# EAGLE schematic export (EAGLE 7.5.0)

## Sheet 1 of 3
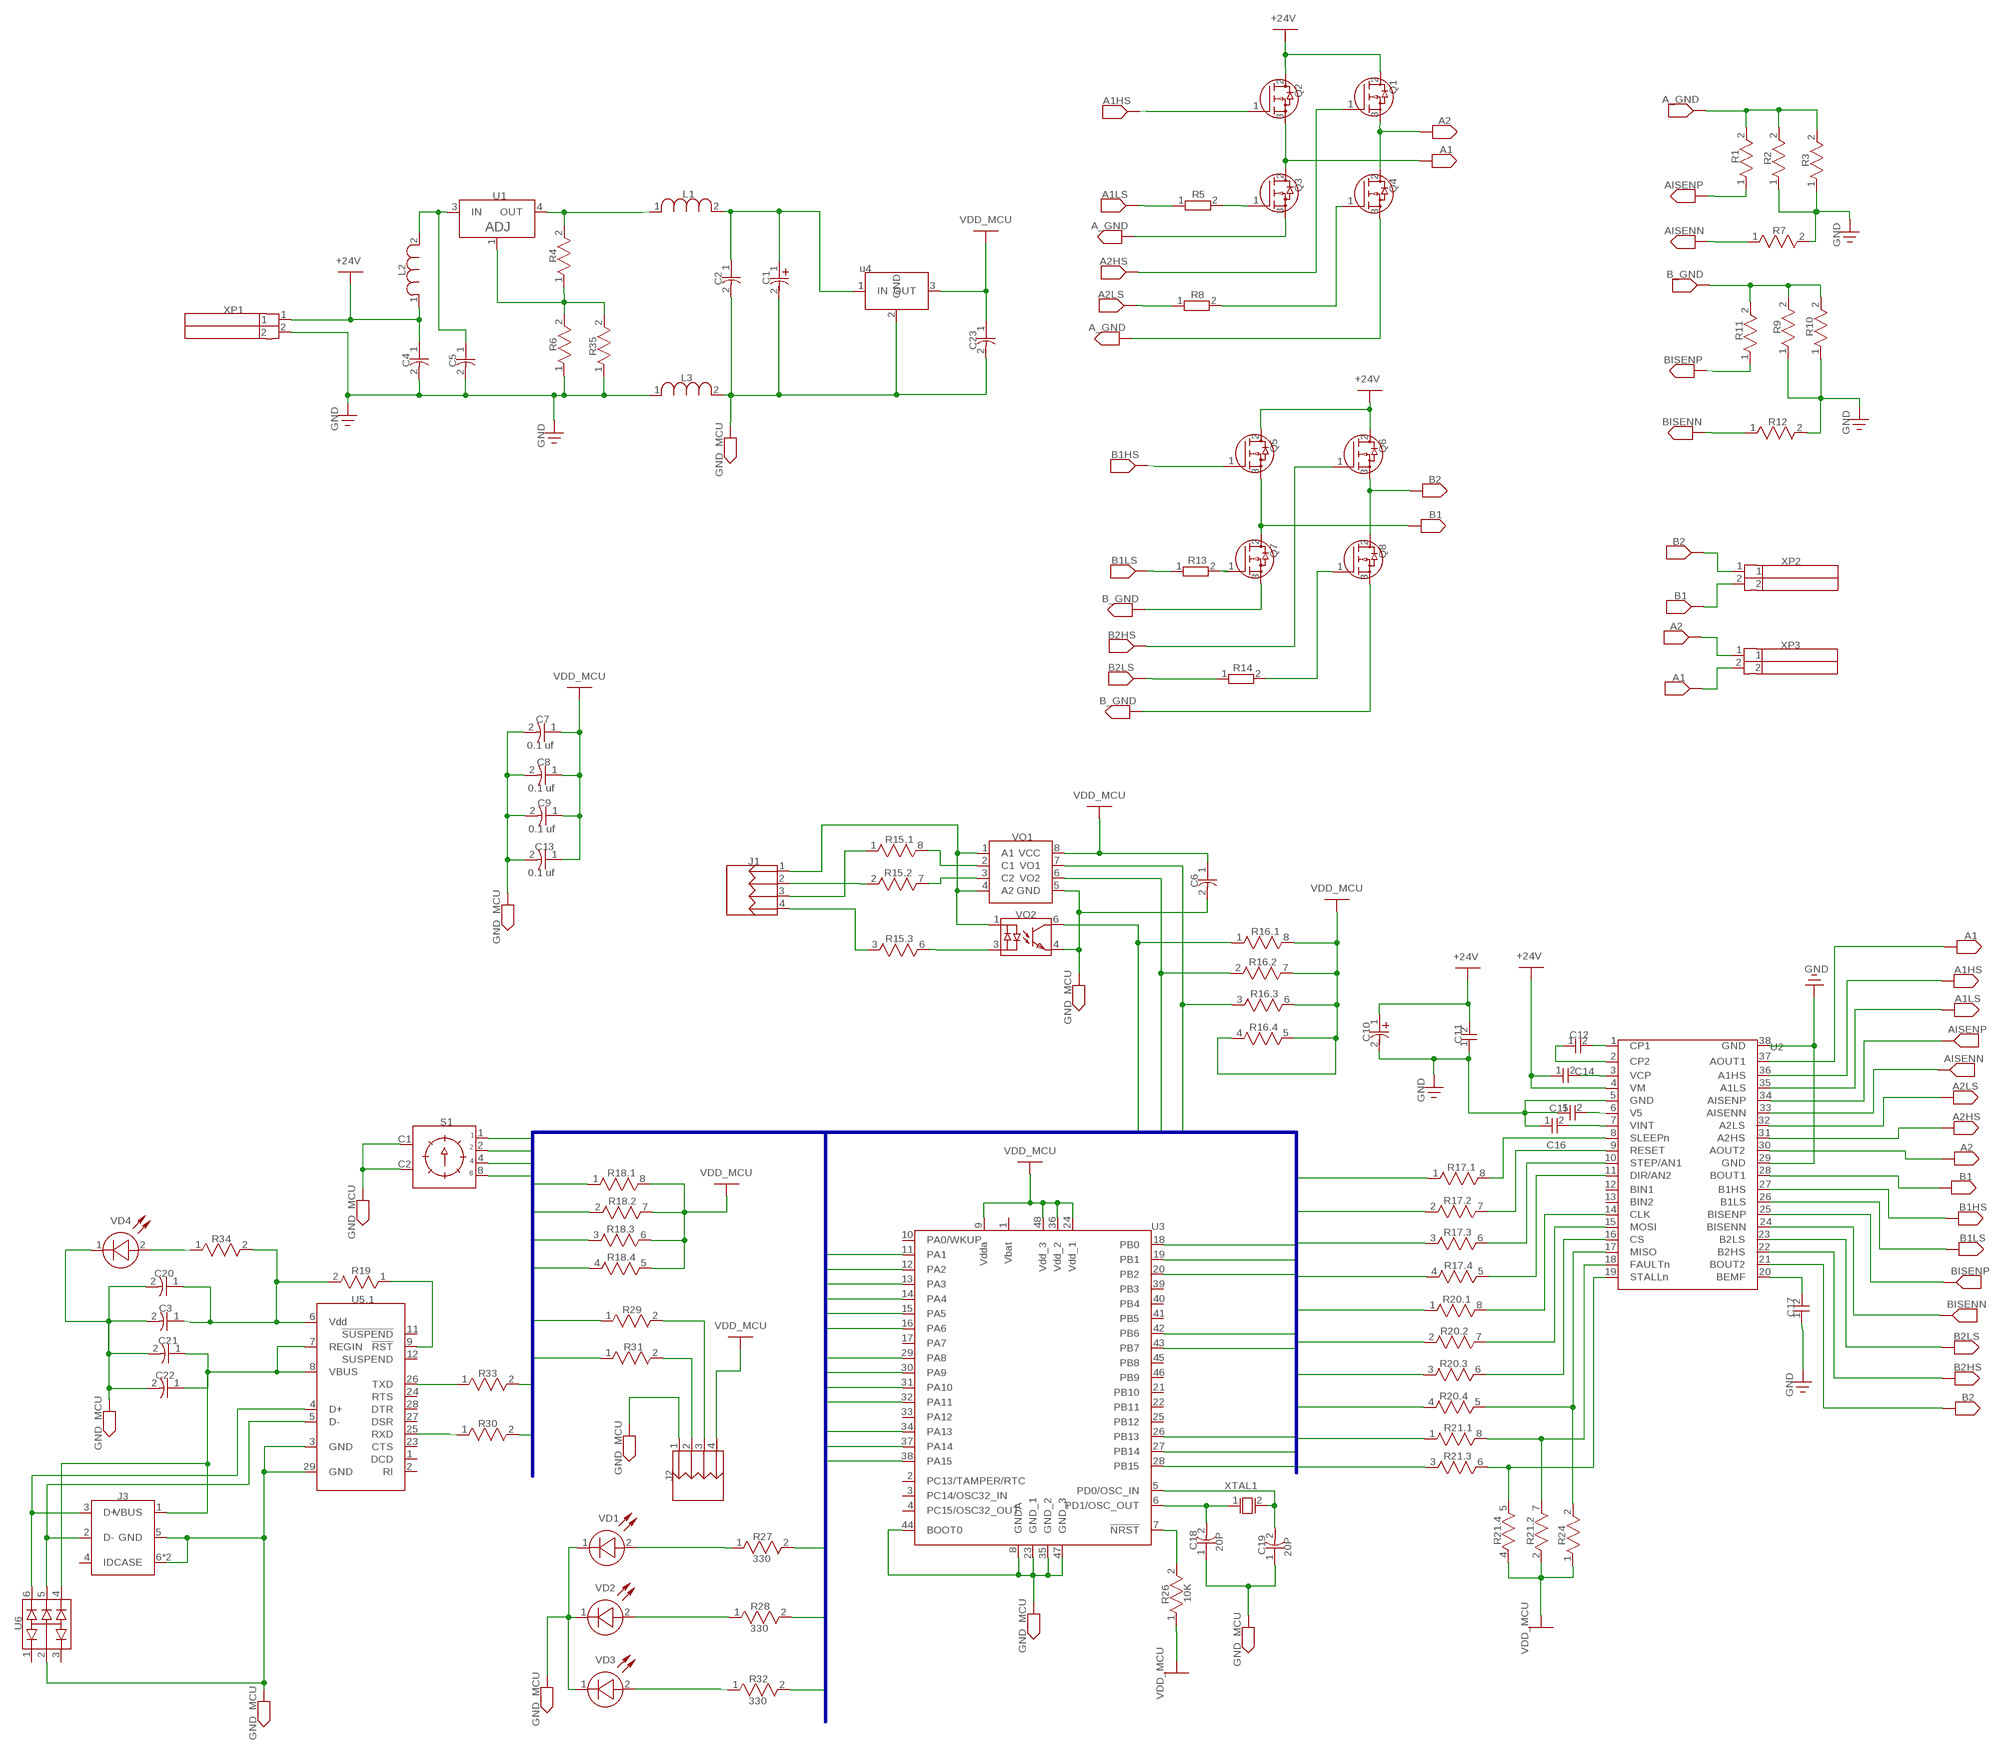
[diagram p0: schematic, sheet 1]

### Parts
C1  220 uf  CAPAE_5.3X5.3H6.1  [CAPAE-5.3X5.3H6.1]
C2  0.1 uf  CAP_0805  [CAP_0805]
C3  CAP_0603  [CAP_0603]
C4  0.1 uf  CAP_0805  [CAP_0805]
C5  0.1 uf  CAP_0805  [CAP_0805]
C6  0.1 uf  CAP_0603  [CAP_0603]
C7  0.1 uf  CAP_0603  [CAP_0603]
C8  0.1 uf  CAP_0603  [CAP_0603]
C9  0.1 uf  CAP_0603  [CAP_0603]
C10  470 uf  CAPAE_6.6X6.6H5.4  [CAPAE-6.6X6.6H5.4]
C11  0.01 uf  SMD_0805  [SMD_0805]
C12  0.1 uf  SMD_0805  [SMD_0805]
C13  0.1 uf  CAP_0603  [CAP_0603]
C14  1 uf  SMD_0805  [SMD_0805]
C15  0.1 uf  SMD_0805  [SMD_0805]
C16  1 uf  SMD_0805  [SMD_0805]
C17  1000 pf  SMD_0805  [SMD_0805]
C18  20P  CAP_0603  [CAP_0603]
C19  20P  CAP_0603  [CAP_0603]
C20  CAP_0603  [CAP_0603]
C21  CAP_0603  [CAP_0603]
C22  CAP_0603  [CAP_0603]
C23  CAP_0805  [CAP_0805]
J1  644456-4  [HDR-1X4T/2.54/10X2]
J2  644456-4  [HDR-1X4T/2.54/10X2]
J3  1734035-1  [1734035]
L1  BLM21PG331SN1D  IND_0805  [IND_0805]
L2  BLM21PG331SN1D  IND_0805  [IND_0805]
L3  BLM21PG331SN1D  IND_0805  [IND_0805]
Q1  CSD18537NKCS  [TO-220_16]
Q2  CSD18537NKCS  [TO-220_16]
Q3  CSD18537NKCS  [TO-220_16]
Q4  CSD18537NKCS  [TO-220_16]
Q5  CSD18537NKCS  [TO-220_16]
Q6  CSD18537NKCS  [TO-220_16]
Q7  CSD18537NKCS  [TO-220_16]
Q8  CSD18537NKCS  [TO-220_16]
R1  0  RES_1206  [RES_1206]
R2  0.01  RES_2512  [RES_2512]
R3  0.01  RES_2512  [RES_2512]
R4  240  RES_0805  [RES_0805]
R5  75  SMD_0805_53  [SMD_0805_54]
R6  750  RES_0805  [RES_0805]
R7  0  RES_1206  [RES_1206]
R8  75  SMD_0805_53  [SMD_0805_54]
R9  0.01  RES_2512  [RES_2512]
R10  0.01  RES_2512  [RES_2512]
R11  0  RES_1206  [RES_1206]
R12  0  RES_1206  [RES_1206]
R13  75  SMD_0805_53  [SMD_0805_54]
R14  75  SMD_0805_53  [SMD_0805_54]
R15  470  ACAS0612AT  [RESCAX-8/1.5X3.2X0.8]
R16  4.7k  ACAS0612AT_18  [RESCAX-8/1.5X3.2X0.8]
R17  120  ACAS0612AT_18  [RESCAX-8/1.5X3.2X0.8]
R18  4.7k  ACAS0612AT_18  [RESCAX-8/1.5X3.2X0.8]
R19  RES_0603  [RES_0603]
R20  120  ACAS0612AT_18  [RESCAX-8/1.5X3.2X0.8]
R21  120  ACAS0612AT_18  [RESCAX-8/1.5X3.2X0.8]
R24  4.7k  RES_0603  [RES_0603]
R26  10K  RES_0603  [RES_0603]
R27  330  RES_0603  [RES_0603]
R28  330  RES_0603  [RES_0603]
R29  120  RES_0603  [RES_0603]
R30  120  RES_0603  [RES_0603]
R31  120  RES_0603  [RES_0603]
R32  330  RES_0603  [RES_0603]
R33  120  RES_0603  [RES_0603]
R34  RES_0603  [RES_0603]
R35  910  RES_0805  [RES_0805]
S1  CD08RM0CB  [CD-C]
U1  LM317D2T  [TO263-3(4)/15X10X2.54]
U2  DRV8711  [PDSOP-G38]
U3  STM32F103C8  [STM32F103C8]
u4  SPX3940-3.3  [TO263-4/10.5X9X2.54]
U5  CP2102  [QFN-28/5X5X0.5]
U6  MF05C  [SMF05C]
VD1  SMD_0805_R  [SMD_0805_R]
VD2  SMD_0805_R  [SMD_0805_R]
VD3  SMD_0805_R  [SMD_0805_R]
VD4  SMD_0805_G  [SMD_0805_G]
VO1  TLP2160  [SOIC-8/150MIL]
VO2  TLP126  [SOP-4V1/7X2.54]
XP1  306_2  [306_2]
XP2  300_2_5  [300_2_5]
XP3  300_2_5  [300_2_5]
XTAL1  8MHz  NX5032GA  [NX5032GA]

### Nets
3V3: C6.1 C7.1 C8.1 C9.1 C13.1 C23.1 J2.4 R16.4 R16.5 R16.6 R16.7 R16.8 R18.5 R18.6 R18.7 R18.8 R21.2 R21.4 R24.1 R26.1 U3.9(Vdda) U3.24(Vdd_1) U3.36(Vdd_2) U3.48(Vdd_3) u4.3(OUT) VO1.8(VCC) ; supply symbol labelled VDD_MCU
A1: Q2.3 Q3.2 U2.37(AOUT1) XP3.2 ; supply symbol labelled A1_46
A1HS: Q2.1 U2.36(A1HS) ; supply symbol labelled A1HS_65
A1LS: R5.1 U2.35(A1LS) ; supply symbol labelled A1LS_21
A2: Q1.3 Q4.2 U2.30(AOUT2) XP3.1 ; supply symbol labelled A2_37
A2HS: Q1.1 U2.31(A2HS) ; supply symbol labelled A2HS_23
A2LS: R8.1 U2.32(A2LS) ; supply symbol labelled A2LS_31
ADDR_0: R18.1 S1.1 U3.29(PA8)
ADDR_1: R18.2 S1.2 U3.30(PA9)
ADDR_2: R18.3 S1.4 U3.31(PA10)
ADDR_3: R18.4 S1.8 U3.32(PA11)
AISENN: R7.1 U2.33(AISENN) ; supply symbol labelled AISENN_58
AISENP: R1.1 U2.34(AISENP) ; supply symbol labelled AISENP_61
B1: Q5.3 Q7.2 U2.28(BOUT1) XP2.2 ; supply symbol labelled B1_44
B1HS: Q5.1 U2.27(B1HS) ; supply symbol labelled B1HS_26
B1LS: R13.1 U2.26(B1LS) ; supply symbol labelled B1LS_33
B2: Q6.3 Q8.2 U2.21(BOUT2) XP2.1 ; supply symbol labelled B2_3
B2HS: Q6.1 U2.22(B2HS) ; supply symbol labelled B2HS_41
B2LS: R14.1 U2.23(B2LS) ; supply symbol labelled B2LS_29
BEMF: C17.2 U2.20(BEMF)
BISENN: R12.1 U2.24(BISENN) ; supply symbol labelled BISENN_39
BISENP: R11.1 U2.25(BISENP) ; supply symbol labelled BISENP_15
CLK_MCU: R20.1 U3.15(PA5)
CP1: C12.2 U2.1(CP1)
CP2: C12.1 U2.2(CP2)
CS_MCU: R20.3 U3.16(PA6)
DIR: R16.3 R17.4 VO1.7(VO1)
E_LED: R27.2 U3.26(PB13)
EN: R16.1 U3.20(PB2) VO2.6(C)
ERROR: R21.1 U3.19(PB1)
GND: C4.2 C5.2 C10.2(MINUS) C11.1 C15.1 C16.1 C17.1 L3.1 R2.1 R3.1 R6.1 R7.2 R9.1 R10.1 R12.2 R35.1 U2.5(GND) U2.29(GND) U2.38(GND) XP1.2 ; supply symbol labelled GND_10
GND_A: Q3.3 Q4.3 R1.2 R2.2 R3.2 ; supply symbol labelled A_GND, A_GND_67
GND_B: Q7.3 Q8.3 R9.2 R10.2 R11.2 ; supply symbol labelled B_GND, B_GND_5
GND_MCU: C1.2(MINUS) C2.2 C3.2 C6.2 C7.2 C8.2 C9.2 C13.2 C18.1 C19.1 C20.2 C21.2 C22.2 C23.2 J2.1 J3.5(GND) J3.6(CASE) J3.8(CASE) L3.2 S1.C1 S1.C2 U3.8(GNDA) U3.23(GND_1) U3.35(GND_2) U3.44(BOOT0) U3.47(GND_3) u4.2(GND) U5.3(GND) U5.29(GND) U6.2 VD1.1 VD2.1 VD3.1 VD4.1 VO1.5(GND) VO2.4(E)
MISO_MCU: R20.4 U3.13(PA3)
MOSI_MCU: R20.2 U3.14(PA4)
Net_0: R17.7 U2.9(RESET)
Net_1: R17.5 U2.11(DIR/AN2)
Net_2: R20.7 U2.15(MOSI)
Net_3: R26.2 U3.7(!NRST)
Net_4: R28.1 VD2.2
Net_5: R27.1 VD1.2
Net_6: R20.6 U2.16(CS)
Net_7: C5.1 L2.2 U1.3(IN)
Net_8: R30.1 U5.25(RXD)
Net_9: Q4.1 R8.2
Net_10: R33.1 U5.26(TXD)
Net_11: J3.3(D+) U5.4(D+) U6.6
Net_12: J3.2(D-) U5.5(D-) U6.5
Net_13: R19.1 U5.9(!RST)
Net_14: R34.1 VD4.2
Net_15: J1.4 R15.3
Net_16: C1.1(PLUS) C2.1 L1.2 u4.1(IN)
Net_27: Q3.1 R5.2
Net_28: R17.8 U2.8(SLEEPn)
Net_29: Q7.1 R13.2
Net_30: R17.6 U2.10(STEP/AN1)
Net_31: R4.1 R6.2 R35.2 U1.1(ADJ)
Net_32: R20.8 U2.14(CLK)
Net_33: C18.2 U3.6(PD1/OSC_OUT) XTAL1.1
Net_34: C19.2 U3.5(PD0/OSC_IN) XTAL1.2
Net_35: R20.5 R24.2 U2.17(MISO)
Net_36: R21.7 R21.8 U2.18(FAULTn)
Net_41: L1.1 R4.2 U1.4(OUT)
Net_64: R21.5 R21.6 U2.19(STALLn)
Net_72: R15.6 VO2.3(CA)
Net_73: J1.1 VO1.1(A1) VO1.4(A2) VO2.1(AC)
Net_74: R15.8 VO1.2(C1)
Net_75: R15.7 VO1.3(C2)
Net_76: J1.2 R15.2
Net_77: J1.3 R15.1
Net_78: R32.1 VD3.2
Net_90: J2.3 R29.2
Net_91: J2.2 R31.2
Net_92: C21.1 C22.1 J3.1(VBUS) U5.7(REGIN) U5.8(VBUS) U6.4
Net_93: C3.1 C20.1 R19.2 R34.2 U5.6(Vdd)
Net_94: Q8.1 R14.2
RESET: R17.2 U3.12(PA2)
RX: R33.2 U3.43(PB7)
S_LED: R28.2 U3.27(PB14)
SEL_CLK: U3.38(PA15)
SLEEP: R17.1 U3.11(PA1)
STALL: R21.3 U3.18(PB0)
STEP: R16.2 R17.3 VO1.6(VO2)
SWCLK: R31.1 U3.37(PA14)
SWDIO: R29.1 U3.34(PA13)
TX: R30.2 U3.42(PB6)
V5: C15.2 U2.6(V5)
VCP: C14.2 U2.3(VCP)
VINT: C16.2 U2.7(VINT)
VM: C4.1 C10.1(PLUS) C11.2 C14.1 L2.1 Q1.2 Q2.2 Q5.2 Q6.2 U2.4(VM) XP1.1 ; supply symbol labelled +24V
W_LED: R32.2 U3.28(PB15)
Unconnected: J3.4(ID) U2.12(BIN1) U2.13(BIN2) U3.2(PC13/TAMPER/RTC) U3.3(PC14/OSC32_IN) U3.4(PC15/OSC32_OUT) U3.10(PA0/WKUP) U3.17(PA7) U3.21(PB10) U3.22(PB11) U3.25(PB12) U3.33(PA12) U3.39(PB3) U3.40(PB4) U3.41(PB5) U3.45(PB8) U3.46(PB9) U5.1(DCD) U5.2(RI) U5.11(!SUSPEND) U5.12(SUSPEND) U5.23(CTS) U5.24(RTS) U5.27(DSR) U5.28(DTR) U6.1 U6.3

### Buses
E_LED,CS_MCU,CLK_MCU,MOSI_MCU,MISO_MCU,ADDR_0,ADDR_1,ADDR_2,ADDR_3,RX,TX,SWDIO,SWCLK,STALL,ERROR,EN,DIR,STEP,SLEEP,RESET,S_LED,W_LED,SEL_CLK

### Notes on the sheet
- +24V
- Q1
- Q2
- A1HS | A_GND
- A2
- A1
- R1 | R2
- R3
- AISENP
- Q3 | Q4
- U1 | L1 | A1LS | R5
- ADJ | VDD_MCU
- A_GND
- AISENN | R7
- GND
- +24V | R4 | A2HS
- u4
- L2 | B_GND
- C2 | C1
- A2LS | R8
- XP1
- A_GND | R9
- R10
- R11
- R6 | C23
- R35
- BISENP
- C4 | C5
- L3 | +24V
- BISENN | R12
- GND
- GND
- GND
- Q5 | Q6
- B1HS
- GND_MCU
- B2
- B1
- B2
- Q7 | Q8
- B1LS | R13 | XP2
- B1
- B_GND
- A2
- B2HS
- XP3
- B2LS | R14
- VDD_MCU | A1
- B_GND
- C7
- 0.1 uf
- C8
- 0.1 uf
- VDD_MCU
- C9
- 0.1 uf
- R15.1 | VO1
- C13
- J1
- 0.1 uf
- R15.2
- C6
- VDD_MCU
- VO2
- R16.1
- R15.3 | A1
- GND_MCU
- +24V | +24V
- R16.2
- GND | A1HS
- R16.3
- A1LS
- GND_MCU
- R16.4 | AISENP
- C12
- C10 | C11
- U2
- AISENN
- C14
- A2LS
- GND
- C15
- A2HS
- S1
- 1
- 2
- C16 | A2
- VDD_MCU
- 4
- 8 | R17.1
- R18.1 | VDD_MCU
- B1
- R18.2 | R17.2
- B1HS
- VD4
- R18.3 | U3
- R17.3
- GND_MCU | B1LS
- R34
- R18.4
- R17.4
- C20 | R19 | BISENP
- U5.1 | R20.1
- BISENN
- C3 | R29
- C17
- VDD_MCU
- R20.2
- B2LS
- C21
- R31
- R20.3
- B2HS
- C22 | R33
- GND
- R20.4 | B2
- R30
- R21.1
- GND_MCU
- R21.3
- GND_MCU
- J2
- XTAL1
- J3
- VD1
- R27
- R21.4 | R21.2 | R24
- C18 | 20P
- 330 | C19 | 20P
- VD2
- R26 | 10K
- R28
- 330
- U6
- GND_MCU | VDD_MCU
- VD3 | GND_MCU
- R32
- 330 | VDD_MCU
- GND_MCU
- GND_MCU

## Sheet 2 of 3

### Buses
E_LED,CS_MCU,CLK_MCU,MOSI_MCU,MISO_MCU,ADDR_0,ADDR_1,ADDR_2,ADDR_3,RX,TX,SWDIO,SWCLK,STALL,ERROR,EN,DIR,STEP,SLEEP,RESET,S_LED,W_LED,SEL_CLK

## Sheet 3 of 3
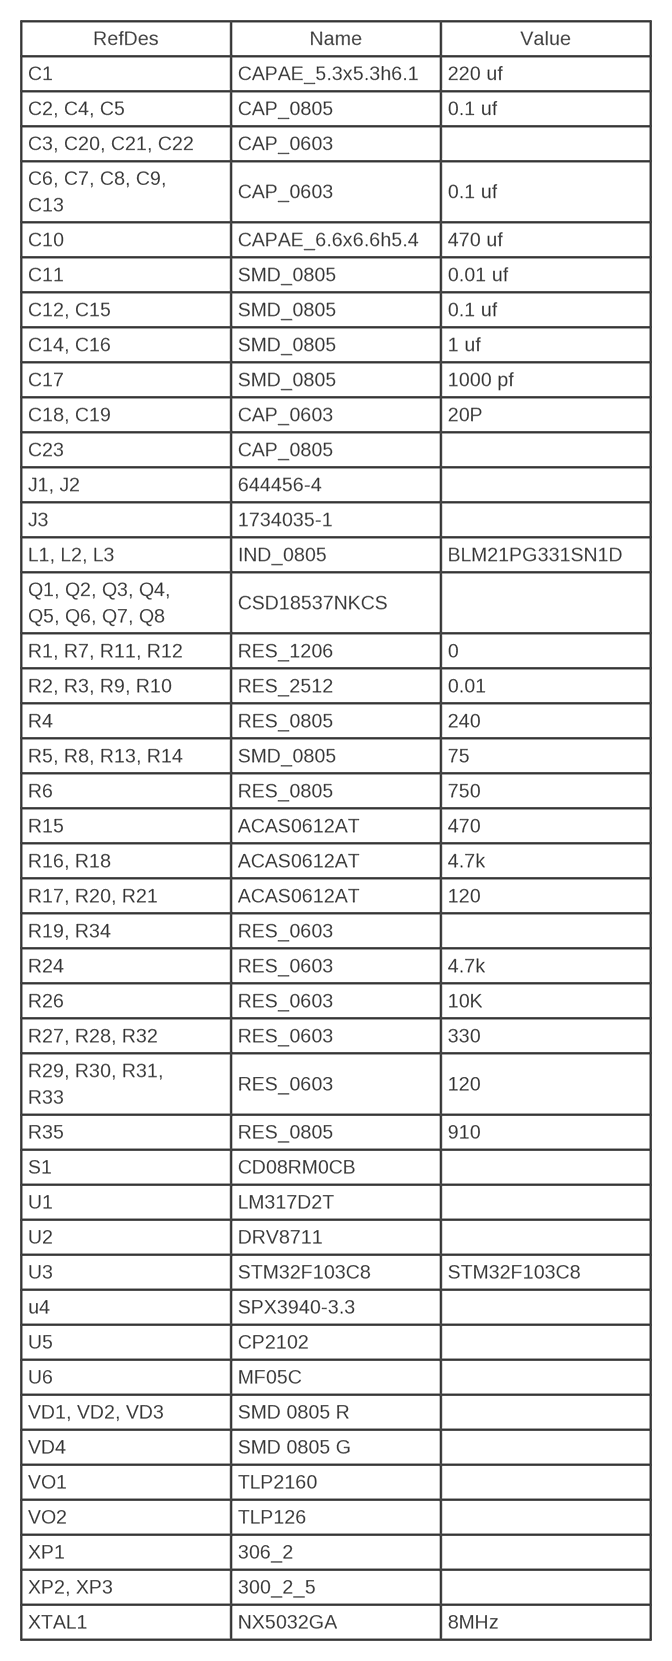
[diagram p1: schematic, sheet 3]

### Buses
E_LED,CS_MCU,CLK_MCU,MOSI_MCU,MISO_MCU,ADDR_0,ADDR_1,ADDR_2,ADDR_3,RX,TX,SWDIO,SWCLK,STALL,ERROR,EN,DIR,STEP,SLEEP,RESET,S_LED,W_LED,SEL_CLK

### Notes on the sheet
- RefDes | Name | Value
- C1 | CAPAE_5.3x5.3h6.1 | 220 uf
- C2, C4, C5 | CAP_0805 | 0.1 uf
- C3, C20, C21, C22 | CAP_0603
- C6, C7, C8, C9,
  C13
- CAP_0603 | 0.1 uf
- C10 | CAPAE_6.6x6.6h5.4 | 470 uf
- C11 | SMD_0805 | 0.01 uf
- C12, C15 | SMD_0805 | 0.1 uf
- C14, C16 | SMD_0805 | 1 uf
- C17 | SMD_0805 | 1000 pf
- C18, C19 | CAP_0603 | 20P
- C23 | CAP_0805
- J1, J2 | 644456-4
- J3 | 1734035-1
- L1, L2, L3 | IND_0805 | BLM21PG331SN1D
- Q1, Q2, Q3, Q4,
  Q5, Q6, Q7, Q8
- CSD18537NKCS
- R1, R7, R11, R12 | RES_1206 | 0
- R2, R3, R9, R10 | RES_2512 | 0.01
- R4 | RES_0805 | 240
- R5, R8, R13, R14 | SMD_0805 | 75
- R6 | RES_0805 | 750
- R15 | ACAS0612AT | 470
- R16, R18 | ACAS0612AT | 4.7k
- R17, R20, R21 | ACAS0612AT | 120
- R19, R34 | RES_0603
- R24 | RES_0603 | 4.7k
- R26 | RES_0603 | 10K
- R27, R28, R32 | RES_0603 | 330
- R29, R30, R31,
  R33
- RES_0603 | 120
- R35 | RES_0805 | 910
- S1 | CD08RM0CB
- U1 | LM317D2T
- U2 | DRV8711
- U3 | STM32F103C8 | STM32F103C8
- u4 | SPX3940-3.3
- U5 | CP2102
- U6 | MF05C
- VD1, VD2, VD3 | SMD 0805 R
- VD4 | SMD 0805 G
- VO1 | TLP2160
- VO2 | TLP126
- XP1 | 306_2
- XP2, XP3 | 300_2_5
- XTAL1 | NX5032GA | 8MHz

## Power pins joined to a net without a drawn wire
Vbat: U3.1(Vbat)

## Library data of the parts
C1 = common:CAPAE_5.3X5.3H6.1
C2 C4 C5 = common:CAP_0805
C3 C6-C9 C13 C18-C22 = common:CAP_0603
C10 = common:CAPAE_6.6X6.6H5.4
C11 = common:SMD_0805
C12 C14-C17 = common:SMD_0805; VALUE: 0.01 uf
C23 = common:CAP_0805; VALUE: 0.1 uf
J1 J2 = common:644456-4; DATASHEET: http://datasheets.diptrace.com/con_headers/ENG_CD_644456_D2.pdf; MANUFACTURER: TE Connectivity
J3 = common:1734035-1; DATASHEET: http://datasheets.diptrace.com/con_usb/1734035.pdf; MANUFACTURER: TE Connectivity
L1-L3 = common:IND_0805
Q1-Q8 = common:CSD18537NKCS
R1 R7 R11 R12 = common:RES_1206
R2 R3 R9 R10 = common:RES_2512
R4 = common:RES_0805
R5 R8 R13 R14 = common:SMD_0805_53
R6 R35 = common:RES_0805; VALUE: 240
R15 = common:ACAS0612AT; DATASHEET: http://datasheets.diptrace.com/rc_networks/ACASA1000E1000P1AT-Vishay-datasheet-8325290.pdf; MANUFACTURER: Vishay
R16 R18 = common:ACAS0612AT_18; DATASHEET: http://datasheets.diptrace.com/rc_networks/ACASA1000E1000P1AT-Vishay-datasheet-8325290.pdf; MANUFACTURER: Vishay
R17 R20 R21 = common:ACAS0612AT_18; DATASHEET: http://datasheets.diptrace.com/rc_networks/ACASA1000E1000P1AT-Vishay-datasheet-8325290.pdf; MANUFACTURER: Vishay; VALUE: 4.7k
R19 R24 R26-R34 = common:RES_0603
S1 = common:CD08RM0CB; DATASHEET: http://datasheets.diptrace.com/switches/CD_series.pdf; MANUFACTURER: C&K
U1 = common:LM317D2T; MANUFACTURER: ON Semiconductor
U2 = common:DRV8711
U3 = common:STM32F103C8
u4 = common:SPX3940-3.3
U5 = common:CP2102; DATASHEET: http://datasheets.diptrace.com/misc/CP2102-9.pdf; MANUFACTURER: Silicon Labs
U6 = common:MF05C
VD1-VD3 = common:SMD_0805_R
VD4 = common:SMD_0805_G
VO1 = common:TLP2160; DATASHEET: http://datasheets.diptrace.com/optoisolators/TLP2160.pdf; MANUFACTURER: Toshiba
VO2 = common:TLP126; DATASHEET: http://datasheets.diptrace.com/optoisolators/TLP126.pdf; MANUFACTURER: Toshiba
XP1 = common:306_2; AUTHOR: Даньковский В.И.; MAIL: dvi534538@mail/ru; WEB: http://vinratel.at.ua/
XP2 XP3 = common:300_2_5; AUTHOR: Даньковский В.И.; MAIL: dvi534538@mail/ru; WEB: http://vinratel.at.ua/
XTAL1 = common:NX5032GA